# Altium schematic sheet Power_Regulation.SchDoc
size A
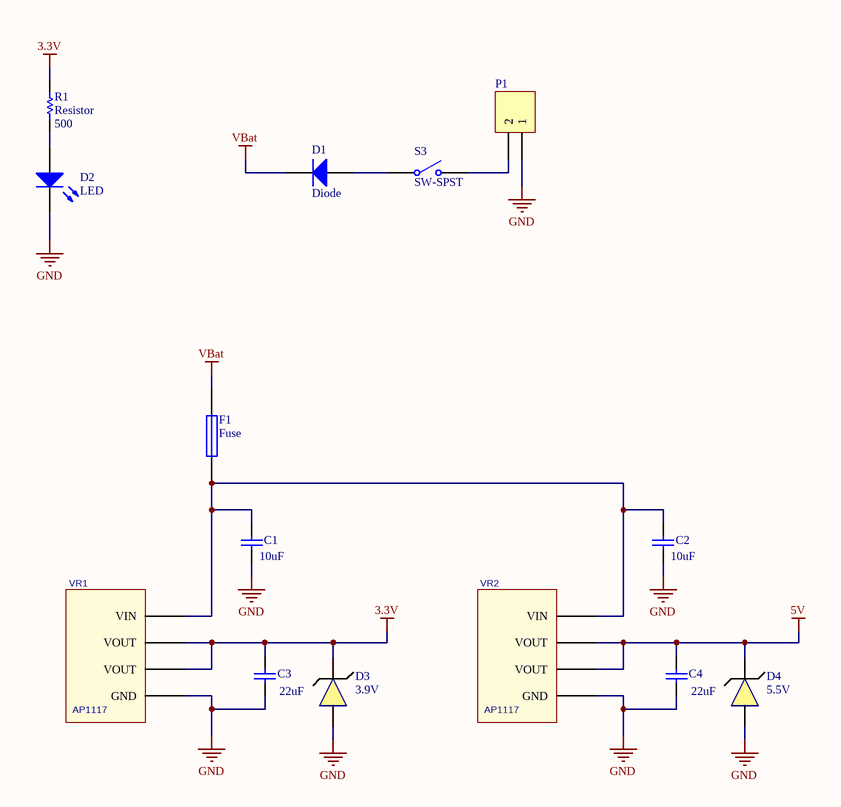
[diagram p0: Power_Regulation.SchDoc]

## Parts
C1  value 10uF  [0805]  (hidden comment: Cap)
C2  value 10uF  [0805]  (hidden comment: Cap)
C3  value 22uF  [0805]  (hidden comment: Cap)
C4  value 22uF  [0805]  (hidden comment: Cap)
D1  Diode  [SMA]
D2  LED  [0603]
D3  3.9V  [DO-214AC]
D4  5.5V  [DO-214AC]
F1  Fuse  [0805]
P1  Header 2  [HDR1X2]  (value not drawn)
R1  Resistor  value 500  [0805]
S3  SW-SPST  [SPST Switch]
VR1  AP1117  [SOT-223]
VR2  AP1117  [SOT-223]

## Nets
3.3V: C3.2 D3.1 R1.2 VR1.2(VOUT) VR1.4(VOUT)
5V: C4.2 D4.1 VR2.2(VOUT) VR2.4(VOUT)
GND: C1.1 C2.1 C3.1 C4.1 D2.2(K) D3.2 D4.2 P1.1 VR1.1(GND) VR2.1(GND)
VBat: D1.2(K) F1.2
NetC1_2: C1.2 C2.2 F1.1 VR1.3(VIN) VR2.3(VIN)
NetD1_1: D1.1(A) S3.1(COMMON)
NetD2_1: D2.1(A) R1.1
NetP1_2: P1.2 S3.2(NO)

## Library data of the parts
C1-C4 = Cap: Capacitor
D1 = Diode: Default Diode
D2 = LED: Vendor Part Number: 751-1203-ND; Manufacturer: Vishay; Manufacturer Part Number: TSAL6100; Vendor: Digikey; Published: 16-Mar-2013; LatestRevisionDate: 16-Mar-2013; LatestRevisionNote: Created; PackageReference: LED; Publisher: Anthony Merlino; PackageDescription: 5mm LED; 2 Leads
D3 D4 = Zener Diode
P1 = Header 2: Header, 2-Pin; LatestRevisionDate: 17-Jul-2002; LatestRevisionNote: Re-released for DXP Platform.; Publisher: Altium Limited
S3 = SW-SPST: Single-Pole, Single-Throw Switch; Published: 24-Mar-1999; LatestRevisionDate: 17-Jul-2002; LatestRevisionNote: Re-released for DXP Platform.; PackageReference: SPST-2; Publisher: Altium Limited; PackageDescription: Switch; 2 Leads
F1 = Fuse: Published: 8-Jun-2000; LatestRevisionDate: 17-Jul-2002; LatestRevisionNote: Re-released for DXP Platform.; PackageReference: PIN-W2/E2.8; Publisher: Altium Limited; PackageDescription: Thru-Hole; 2 Leads
R1 = Resistor: Published: 8-Jun-2000; LatestRevisionDate: 17-Jul-2002; LatestRevisionNote: Re-released for DXP Platform.; PackageReference: AXIAL-0.3; Publisher: Altium Limited
VR1 VR2 = AP1117: Value: *